# Altium schematic sheet 最小系统.SchDoc
size A4
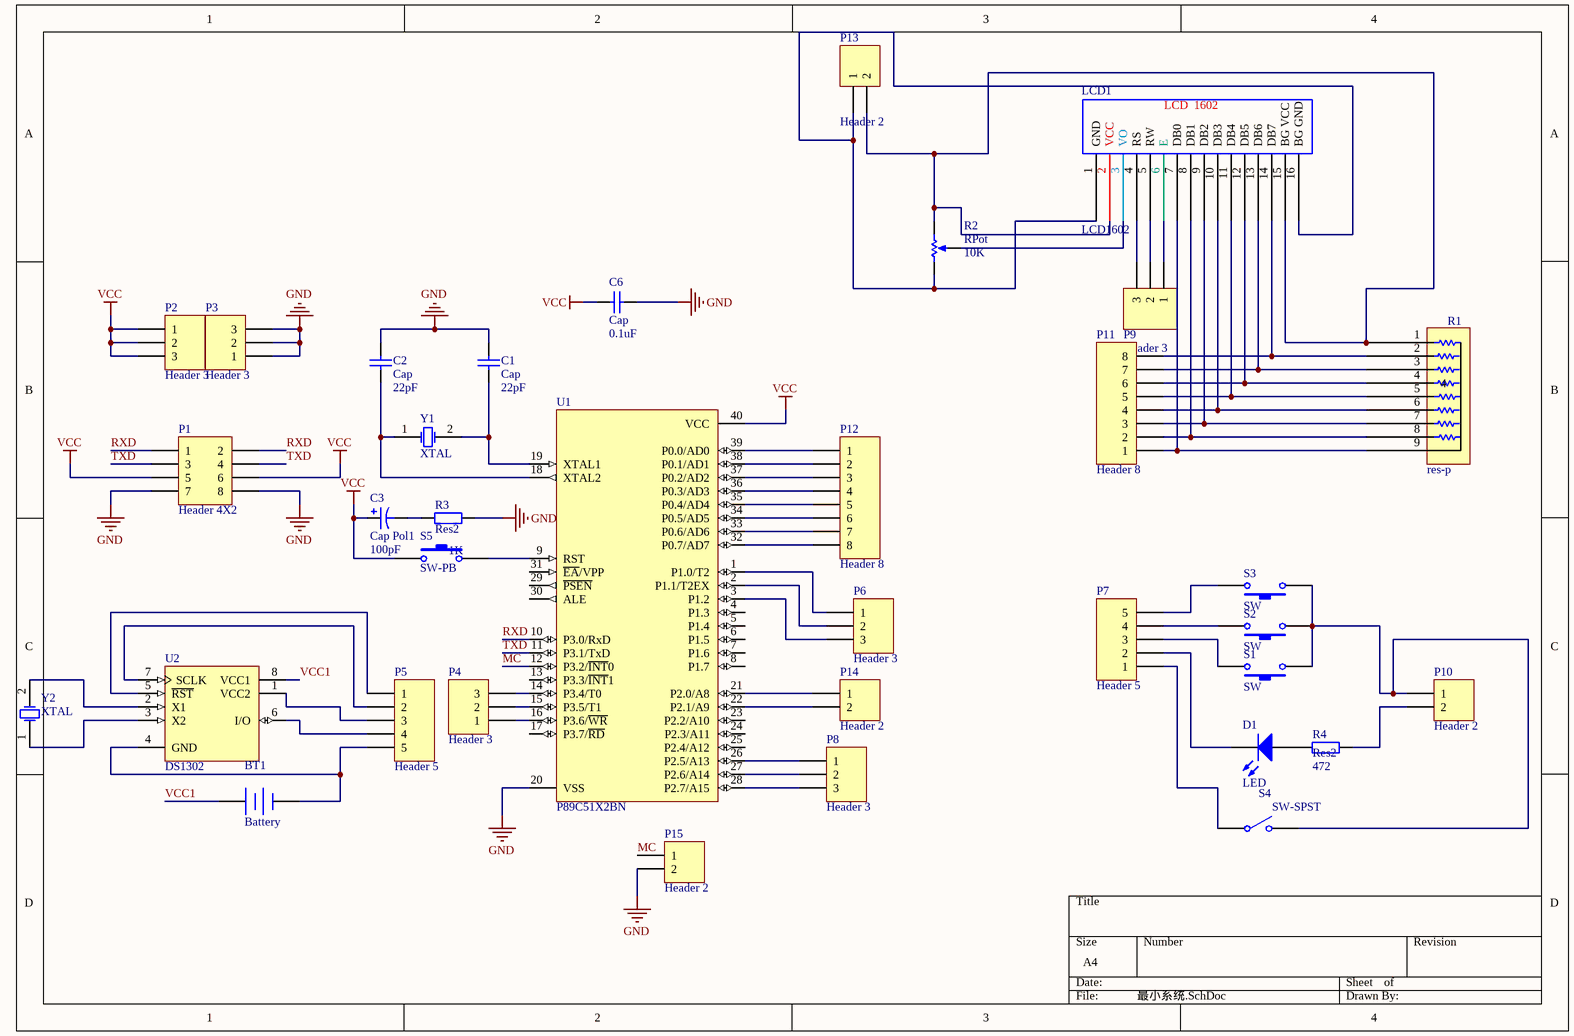
[diagram p0: 最小系统.SchDoc]

## Parts
BT1  Battery  [BAT-2]
C1  Cap  value 22pF  [CAPR2.54-5.1x3.2]
C2  Cap  value 22pF  [CAPR2.54-5.1x3.2]
C3  Cap Pol1  value 100pF  [CAPPR1.27-1.7x2.8]
C6  Cap  value 0.1uF  [RAD-0.3]
D1  LED  [LED-1]
LCD1  LCD1602  [1602LCD]
P1  Header 4X2  [HDR2X4]
P2  Header 3  [HDR1X3]
P3  Header 3  [HDR1X3]
P4  Header 3  [HDR1X3]
P5  Header 5  [HDR1X5]
P6  Header 3  [HDR1X3]
P7  Header 5  [HDR1X5]
P8  Header 3  [HDR1X3]
P9  Header 3  [HDR1X3]
P10  Header 2  [HDR1X2]
P11  Header 8  [HDR1X8]
P12  Header 8  [HDR1X8]
P13  Header 2  [HDR1X2]
P14  Header 2  [HDR1X2]
P15  Header 2  [HDR1X2]
R1  res-p  [HDR1X9]
R2  RPot  value 10K  [VR5]
R3  Res2  value 1K  [AXIAL-0.4]
R4  Res2  value 472  [AXIAL-0.4]
S1  SW  [SW/PB-V4/H7.1]
S2  SW  [SW/PB-V4/H7.1]
S3  SW  [SW/PB-V4/H7.1]
S4  SW-SPST  [SPST-2]
S5  SW-PB  [SW/PB-V4/H7.1]
U1  P89C51X2BN  [SOT129-1]
U2  DS1302  [DIP8]
Y1  XTAL  [BCY-W2/D3.1]
Y2  XTAL  [BCY-W2/D3.1]

## Nets
GND: C1.2 C2.2 C6.2 P1.7 P1.8 P3.1 P3.2 P3.3 P15.2 R3.2 U1.20(VSS)
VCC: C3.1 C6.1 P1.5 P1.6 P2.1 P2.2 P2.3 S5.1 U1.40(VCC)
MC: P15.1 U1.12(P3.2/~{INT}0)
RXD: P1.1 P1.2 U1.10(P3.0/RxD)
TXD: P1.3 P1.4 U1.11(P3.1/TxD)
VCC1: BT1.1(+) U2.8(VCC1)
NetBT1_2: BT1.2(-) P5.5 U2.4(GND)
NetC1_1: C1.1 U1.19(XTAL1) Y1.2(OSC2)
NetC2_1: C2.1 U1.18(XTAL2) Y1.1(OSC1)
NetC3_2: C3.2 R3.1
NetD1_1: D1.1(A) R4.1
NetD1_2: D1.2(K) P7.2
NetLCD1_1: LCD1.1(GND) LCD1.16(BG_GND) P13.1 R2.1(TOP)
NetLCD1_2: LCD1.2(VCC) LCD1.15(BG_VCC) P13.2 R1.1 R2.2(BOT)
NetLCD1_3: LCD1.3(VO) R2.3(TAP)
NetLCD1_4: LCD1.4(RS) P9.3
NetLCD1_5: LCD1.5(RW) P9.2
NetLCD1_6: LCD1.6(E) P9.1
NetLCD1_7: LCD1.7(DB0) P11.1 R1.9
NetLCD1_8: LCD1.8(DB1) P11.2 R1.8
NetLCD1_9: LCD1.9(DB2) P11.3 R1.7
NetLCD1_10: LCD1.10(DB3) P11.4 R1.6
NetLCD1_11: LCD1.11(DB4) P11.5 R1.5
NetLCD1_12: LCD1.12(DB5) P11.6 R1.4
NetLCD1_13: LCD1.13(DB6) P11.7 R1.3
NetLCD1_14: LCD1.14(DB7) P11.8 R1.2
NetP4_1: P4.1 U1.16(P3.6/~{WR})
NetP4_2: P4.2 U1.15(P3.5/T1)
NetP4_3: P4.3 U1.14(P3.4/T0)
NetP5_1: P5.1 U2.5(~{RST})
NetP5_2: P5.2 U2.7(SCLK)
NetP5_3: P5.3 U2.1(VCC2)
NetP5_4: P5.4 U2.6(I/O)
NetP6_1: P6.1 U1.1(P1.0/T2)
NetP6_2: P6.2 U1.2(P1.1/T2EX)
NetP6_3: P6.3 U1.3(P1.2)
NetP7_1: P7.1 S4.1(COMMON)
NetP7_3: P7.3 S1.2
NetP7_4: P7.4 S2.2
NetP7_5: P7.5 S3.2
NetP8_1: P8.1 U1.26(P2.5/A13)
NetP8_2: P8.2 U1.27(P2.6/A14)
NetP8_3: P8.3 U1.28(P2.7/A15)
NetP10_1: P10.1 S1.1 S2.1 S3.1 S4.2(NO)
NetP10_2: P10.2 R4.2
NetP12_1: P12.1 U1.39(P0.0/AD0)
NetP12_2: P12.2 U1.38(P0.1/AD1)
NetP12_3: P12.3 U1.37(P0.2/AD2)
NetP12_4: P12.4 U1.36(P0.3/AD3)
NetP12_5: P12.5 U1.35(P0.4/AD4)
NetP12_6: P12.6 U1.34(P0.5/AD5)
NetP12_7: P12.7 U1.33(P0.6/AD6)
NetP12_8: P12.8 U1.32(P0.7/AD7)
NetP14_1: P14.1 U1.21(P2.0/A8)
NetP14_2: P14.2 U1.22(P2.1/A9)
NetS5_2: S5.2 U1.9(RST)
NetU2_2: U2.2(X1) Y2.2(OSC2)
NetU2_3: U2.3(X2) Y2.1(OSC1)

Not connected (* = marked no-connect by the designer): U1 4(P1.3) 5(P1.4) 6(P1.5) 7(P1.6) 8(P1.7) 13(P3.3/~{INT}1) 17(P3.7/~{RD}) 23(P2.2/A10) 24(P2.3/A11) 25(P2.4/A12) 29(~{PSEN}) 30(ALE) 31(~{EA}/VPP)

## Notes on the sheet
- (in symbol LCD1602) LCD  1602

## Library data of the parts
BT1 = Battery: Multicell Battery; Published: 24-Mar-1999; LatestRevisionDate: 17-Jul-2002; LatestRevisionNote: Re-released for DXP Platform.; Publisher: Altium Limited
C1 C2 C6 = Cap: Capacitor; Published: 8-Jun-2000; LatestRevisionDate: 17-Jul-2002; LatestRevisionNote: Re-released for DXP Platform.; Publisher: Altium Limited
  C1 C2: PackageReference: RAD-0.3
C3 = Cap Pol1: Polarized Capacitor (Radial); Published: 8-Jun-2000; LatestRevisionDate: 17-Jul-2002; LatestRevisionNote: Re-released for DXP Platform.; Publisher: Altium Limited
P1 = Header 4X2: Header, 4-Pin, Dual row; LatestRevisionDate: 17-Jul-2002; LatestRevisionNote: Re-released for DXP Platform.; Publisher: Altium Limited
P2-P4 P6 P8 P9 = Header 3: Header, 3-Pin; LatestRevisionDate: 17-Jul-2002; LatestRevisionNote: Re-released for DXP Platform.; Publisher: Altium Limited
P5 P7 = Header 5: Header, 5-Pin; LatestRevisionDate: 17-Jul-2002; LatestRevisionNote: Re-released for DXP Platform.; Publisher: Altium Limited
P10 P13-P15 = Header 2: Header, 2-Pin; LatestRevisionDate: 17-Jul-2002; LatestRevisionNote: Re-released for DXP Platform.; Publisher: Altium Limited
P11 P12 = Header 8: Header, 8-Pin; LatestRevisionDate: 17-Jul-2002; LatestRevisionNote: Re-released for DXP Platform.; Publisher: Altium Limited
R2 = RPot: Potentiometer; Sim Note: Enter the Resistance value and the set point into parameter fields.; Set Position: 0.5; Published: 8-Jun-2000; LatestRevisionDate: 17-Jul-2002; LatestRevisionNote: Re-released for DXP Platform.; Publisher: Altium Limited
R3 R4 = Res2: Resistor; Published: 8-Jun-2000; LatestRevisionDate: 17-Jul-2002; LatestRevisionNote: Re-released for DXP Platform.; Publisher: Altium Limited
S1-S3 = SWITCH
S4 = SW-SPST: Single-Pole, Single-Throw Switch; Published: 24-Mar-1999; LatestRevisionDate: 17-Jul-2002; LatestRevisionNote: Re-released for DXP Platform.; PackageReference: SPST-2; Publisher: Altium Limited
S5 = SW-PB: Switch; Published: 24-Mar-1999; LatestRevisionDate: 17-Jul-2002; LatestRevisionNote: Re-released for DXP Platform.; Publisher: Altium Limited
U1 = P89C51X2BN: 80C51 8-Bit Flash Microcontroller Family, 4 kB Flash; Published: 21-May-2003; DatasheetVersion: 5-Jun-2002; PackageVersion: Aug-2000; PackageReference: SOT129-1; Publisher: Altium Limited; PackageDescription: DIP, Plastic; 40 Leads; Row Spacing 15.24 mm; Pitch 2.54 mm; Code_JEDEC: MO-015; ComponentLink1Description: Manufacturer Link; ComponentLink1URL: http://www-us2.semiconductors.philips.com/; ComponentLink2Description: Datasheet; ComponentLink2URL: http://www.semiconductors.philips.com/acrobat/datasheets/P89C5XX2_2.pdf
U2 = DS1302: Trickle Charge Timekeeping Chip; Published: 13-Oct-2000; LatestRevisionDate: 06-Jun-2005; LatestRevisionNote: Stylized 3D Model Added.; DatasheetVersion: 2-Jul-1999; PackageVersion: 1999; PackageReference: DIP8; Publisher: Altium Limited; PackageDescription: DIP; 8 Leads; Row Spacing 7.62 mm; Pitch 2.54 mm; ComponentLink1Description: Manufacturer Link; ComponentLink1URL: http://www.maxim-ic.com/; ComponentLink2Description: Datasheet; ComponentLink2URL: http://pdfserv.maxim-ic.com/en/ds/DS1302.pdf
Y1 Y2 = XTAL: Crystal Oscillator; Published: 8-Jun-2000; LatestRevisionDate: 17-Jul-2002; LatestRevisionNote: Re-released for DXP Platform.; PackageReference: R38; Publisher: Altium Limited